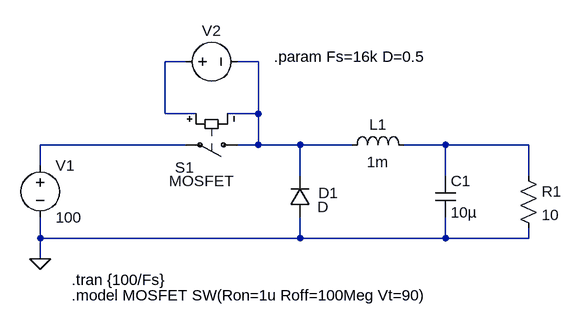
[diagram p0: schematic v1.0.asc]
v1.0.asc, the LTspice schematic file:
Version 4.1
SHEET 1 1244 680
WIRE 96 -32 64 -32
WIRE 208 -32 176 -32
WIRE 64 48 64 -32
WIRE 112 48 64 48
WIRE 208 48 208 -32
WIRE 208 48 160 48
WIRE 96 96 -128 96
WIRE 208 96 208 48
WIRE 208 96 176 96
WIRE 272 96 208 96
WIRE 352 96 272 96
WIRE 496 96 432 96
WIRE 624 96 496 96
WIRE -128 128 -128 96
WIRE 272 144 272 96
WIRE 496 144 496 96
WIRE 624 144 624 96
WIRE -128 240 -128 208
WIRE 272 240 272 208
WIRE 272 240 -128 240
WIRE 496 240 496 208
WIRE 496 240 272 240
WIRE 624 240 624 224
WIRE 624 240 496 240
WIRE -128 272 -128 240
FLAG -128 272 0
SYMBOL voltage -128 112 R0
WINDOW 123 0 0 Left 0
WINDOW 39 0 0 Left 0
SYMATTR InstName V1
SYMATTR Value 100
SYMBOL diode 288 208 R180
WINDOW 0 -43 38 Left 2
WINDOW 3 -28 16 Left 2
SYMATTR InstName D1
SYMBOL ind 336 112 R270
WINDOW 0 32 56 VTop 2
WINDOW 3 5 56 VBottom 2
SYMATTR InstName L1
SYMATTR Value 1m
SYMBOL cap 480 144 R0
SYMATTR InstName C1
SYMATTR Value 10µ
SYMBOL res 608 128 R0
SYMATTR InstName R1
SYMATTR Value 10
SYMBOL sw 192 96 R90
WINDOW 0 35 83 VRight 2
WINDOW 3 56 21 VRight 2
SYMATTR InstName S1
SYMATTR Value MOSFET
SYMBOL voltage 80 -32 R270
WINDOW 0 32 56 VTop 2
WINDOW 3 -32 56 Invisible 2
WINDOW 123 0 0 Left 0
WINDOW 39 0 0 Left 0
SYMATTR InstName V2
SYMATTR Value PULSE(0 100 0 1n 1n {D/Fs} {1/Fs} 1Meg)
TEXT -80 304 Left 2 !.tran {100/Fs}
TEXT -80 328 Left 2 !.model MOSFET SW(Ron=1u Roff=100Meg Vt=90)
TEXT 232 -40 Left 2 !.param Fs=16k D=0.5

The netlist it stands for:
* v1.0.asc
V1 N003 0 100
D1 0 N002 D
L1 N002 N004 1m
C1 N004 0 10µ
R1 N004 0 10
S1 N002 N003 N001 N002 MOSFET
V2 N001 N002 PULSE(0 100 0 1n 1n {D/Fs} {1/Fs} 1Meg)
.model D D
.lib standard.dio
.tran {100/Fs}
.model MOSFET SW(Ron=1u Roff=100Meg Vt=90)
.param Fs=16k D=0.5
.backanno
.end